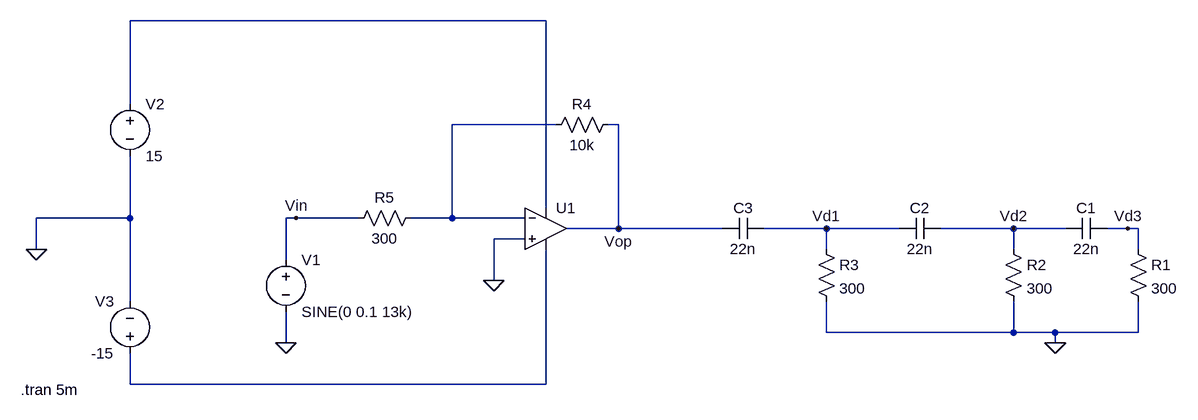
[diagram p0: schematic Figure 10.asc]
Figure 10.asc, the LTspice schematic file:
Version 4
SHEET 1 880 680
WIRE -544 -176 -1184 -176
WIRE -1184 -48 -1184 -176
WIRE -528 -16 -688 -16
WIRE -432 -16 -448 -16
WIRE -544 112 -544 -176
WIRE -1184 128 -1184 32
WIRE -1184 128 -1328 128
WIRE -928 128 -944 128
WIRE -832 128 -928 128
WIRE -688 128 -688 -16
WIRE -688 128 -752 128
WIRE -576 128 -688 128
WIRE -432 144 -432 -16
WIRE -432 144 -512 144
WIRE -272 144 -432 144
WIRE -112 144 -208 144
WIRE 0 144 -112 144
WIRE 176 144 64 144
WIRE 256 144 176 144
WIRE 352 144 320 144
WIRE 368 144 352 144
WIRE -576 160 -624 160
WIRE -1328 176 -1328 128
WIRE -112 176 -112 144
WIRE 176 176 176 144
WIRE 368 176 368 144
WIRE -944 192 -944 128
WIRE -624 224 -624 160
WIRE -1184 256 -1184 128
WIRE -112 304 -112 256
WIRE 176 304 176 256
WIRE 176 304 -112 304
WIRE 240 304 176 304
WIRE 368 304 368 256
WIRE 368 304 240 304
WIRE -944 320 -944 272
WIRE 240 320 240 304
WIRE -1184 384 -1184 336
WIRE -544 384 -544 176
WIRE -544 384 -1184 384
FLAG 240 320 0
FLAG -624 224 0
FLAG -1328 176 0
FLAG -944 320 0
FLAG -928 128 Vin
FLAG -432 144 Vop
FLAG 352 144 Vd3
FLAG 176 144 Vd2
FLAG -112 144 Vd1
SYMBOL res 352 160 R0
SYMATTR InstName R1
SYMATTR Value 300
SYMBOL res 160 160 R0
SYMATTR InstName R2
SYMATTR Value 300
SYMBOL cap 320 128 R90
WINDOW 0 0 32 VBottom 2
WINDOW 3 32 32 VTop 2
SYMATTR InstName C1
SYMATTR Value 22n
SYMBOL cap 64 128 R90
WINDOW 0 0 32 VBottom 2
WINDOW 3 32 32 VTop 2
SYMATTR InstName C2
SYMATTR Value 22n
SYMBOL res -128 160 R0
SYMATTR InstName R3
SYMATTR Value 300
SYMBOL cap -208 128 R90
WINDOW 0 0 32 VBottom 2
WINDOW 3 32 32 VTop 2
SYMATTR InstName C3
SYMATTR Value 22n
SYMBOL Opamps\\UniversalOpamp2 -544 144 R0
SYMATTR InstName U1
SYMBOL res -432 -32 R90
WINDOW 0 0 56 VBottom 2
WINDOW 3 32 56 VTop 2
SYMATTR InstName R4
SYMATTR Value 10k
SYMBOL res -736 112 R90
WINDOW 0 0 56 VBottom 2
WINDOW 3 32 56 VTop 2
SYMATTR InstName R5
SYMATTR Value 300
SYMBOL voltage -944 176 R0
WINDOW 123 0 0 Left 0
WINDOW 39 0 0 Left 0
SYMATTR InstName V1
SYMATTR Value SINE(0 0.1 13k)
SYMBOL voltage -1184 -64 R0
WINDOW 123 0 0 Left 0
WINDOW 39 0 0 Left 0
SYMATTR InstName V2
SYMATTR Value 15
SYMBOL voltage -1184 352 R180
WINDOW 0 24 96 Left 2
WINDOW 3 24 16 Left 2
WINDOW 123 0 0 Left 0
WINDOW 39 0 0 Left 0
SYMATTR InstName V3
SYMATTR Value -15
TEXT -1352 392 Left 2 !.tran 5m

The netlist it stands for:
* Figure 10.asc
R1 Vd3 0 300
R2 Vd2 0 300
C1 Vd3 Vd2 22n
C2 Vd2 Vd1 22n
R3 Vd1 0 300
C3 Vd1 Vop 22n
XU1 0 N002 N001 N003 Vop level.2 Avol=1Meg GBW=10Meg Slew=10Meg ilimit=25m rail=0 Vos=0 phimargin=45 en=0 enk=0 in=0 ink=0 Rin=500Meg  ; pins IN+ IN- V+ V- OUT
R4 Vop N002 10k
R5 N002 Vin 300
V1 Vin 0 SINE(0 0.1 13k)
V2 N001 0 15
V3 N003 0 -15
.tran 5m
.lib UniversalOpamps2.sub
.backanno
.end